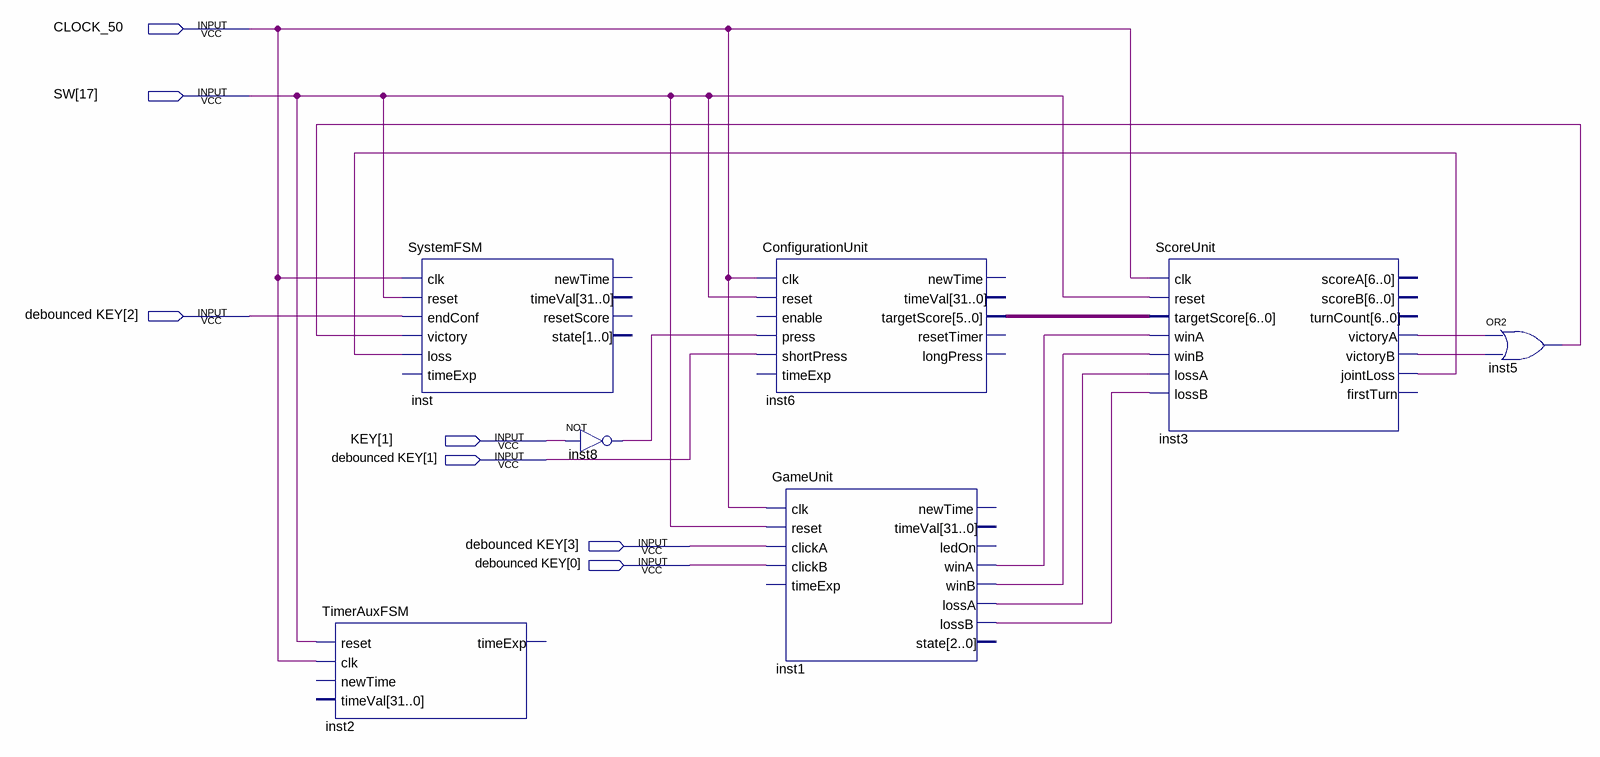
[diagram p0: schematic sheet]
// Quartus schematic top_level_schematic.bdf as structural Verilog: 7 symbols, 7 pins
module top_level_schematic (
  input  CLOCK_50,
  input  [17:17] SW,
  input  [3:0] \debounced_KEY ,
  input  [1:1] KEY
);

  wire inst1_lossa, inst1_lossb, inst1_wina, inst1_winb, inst3_jointloss, inst3_victorya, inst3_victoryb,
       inst5_out, inst8_out;
  wire [6:0] inst6_targetscore;

  TimerAuxFSM inst2 (.reset(SW[17]), .clk(CLOCK_50));  // open: newTime, timeVal, timeExp
  SystemFSM inst (
    .clk(CLOCK_50), .reset(SW[17]), .endConf(\debounced_KEY [2]), .victory(inst5_out), .loss(inst3_jointloss));  // open: timeExp, newTime, timeVal, resetScore, state
  not inst8 (inst8_out, KEY[1]);
  ConfigurationUnit inst6 (
    .clk(CLOCK_50), .reset(SW[17]), .press(inst8_out), .shortPress(\debounced_KEY [1]),
    .targetScore(inst6_targetscore));  // open: enable, timeExp, newTime, timeVal, resetTimer, longPress
  GameUnit inst1 (
    .clk(CLOCK_50), .reset(SW[17]), .clickA(\debounced_KEY [3]), .clickB(\debounced_KEY [0]),
    .winA(inst1_wina), .winB(inst1_winb), .lossA(inst1_lossa), .lossB(inst1_lossb));  // open: timeExp, newTime, timeVal, ledOn, state
  ScoreUnit inst3 (
    .clk(CLOCK_50), .reset(SW[17]), .targetScore(inst6_targetscore), .winA(inst1_wina), .winB(inst1_winb),
    .lossA(inst1_lossa), .lossB(inst1_lossb), .victoryA(inst3_victorya), .victoryB(inst3_victoryb),
    .jointLoss(inst3_jointloss));  // open: scoreA, scoreB, turnCount, firstTurn
  or inst5 (inst5_out, inst3_victorya, inst3_victoryb);
endmodule
